# EAGLE design IMU_V1.0 (EAGLE 9.4.1)
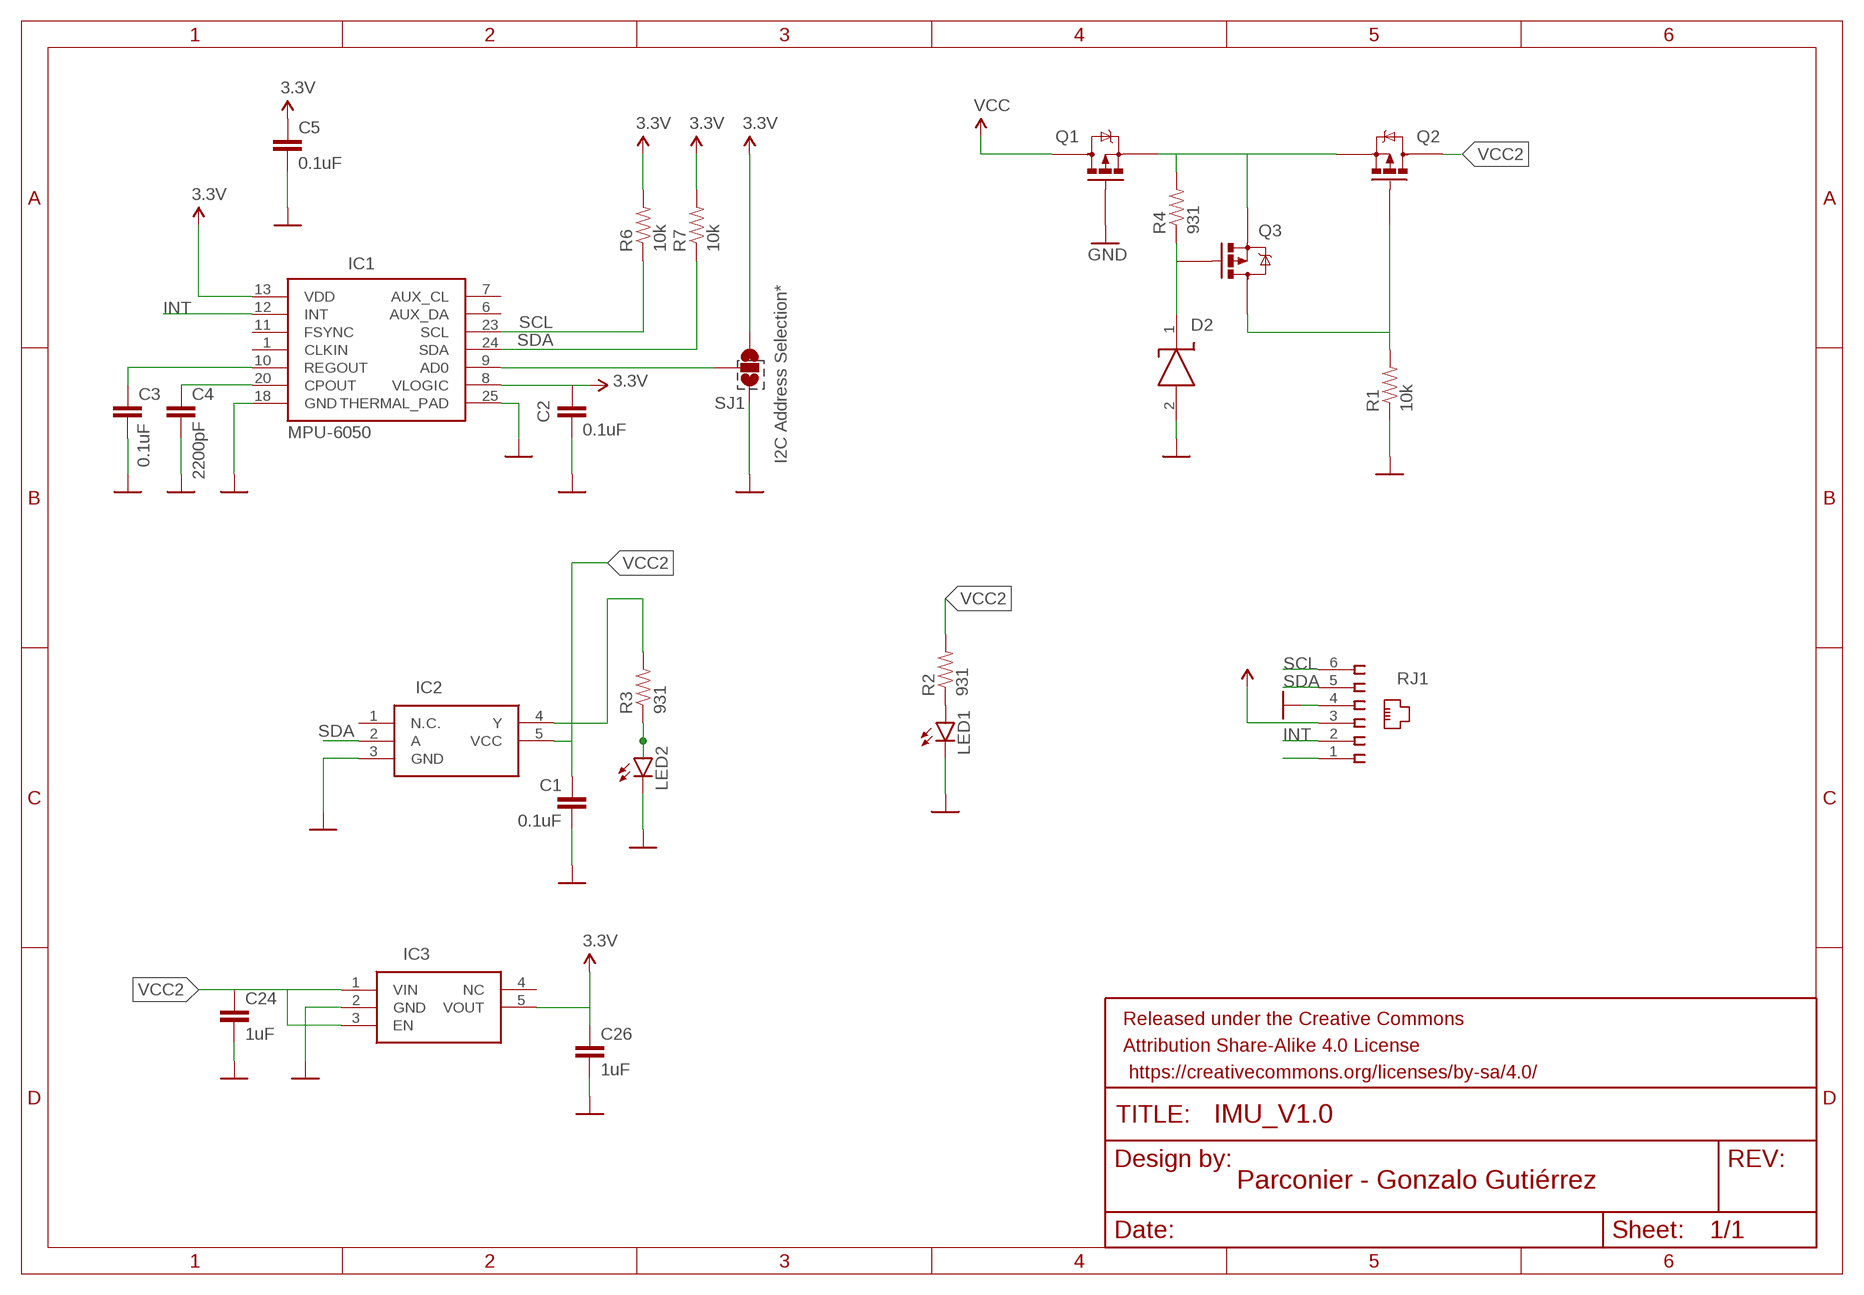
[diagram p0: schematic, sheet 1]

## Parts
C1  0.1uF  CAP_0402  [0402]
C2  0.1uF  CAP_0402  [0402]
C3  0.1uF  CAP_0402  [0402]
C4  2200pF  CAP_0402  [0402]
C5  0.1uF  CAP_0402  [0402]
C24  1uF  CAP_0402  [0402]
C26  1uF  CAP_0402  [0402]
D2  BZT52C5V1-7-F  [SOD3716X145N]
IC1  MPU-6050  [QFN50P400X400X95-25N]
IC2  74LVC1G14GW-Q100,1  [SOT65P212X110-5N]
IC3  MIC5504-3.3YM5-TR  [SOT95P280X145-5N]
LED1  LED0603  [LED-0603]
LED2  LED0603  [LED-0603]
Q1  RU1C002ZPTCL  [SOTFL65P210X105-3N]
Q2  RU1C002ZPTCL  [SOTFL65P210X105-3N]
Q3  RU1C002ZPTCL  [SOTFL65P210X105-3N]
R1  10k  RES_0402  [RESC1005X35]
R2  931  RES_0402  [RESC1005X35]
R3  931  RES_0402  [RESC1005X35]
R4  931  RES_0402  [RESC1005X35]
R6  10k  RES_0402  [RESC1005X35]
R7  10k  RES_0402  [RESC1005X35]
RJ1  615006138421  [615006138421]
SJ1  SOLDERJUMPER_2WAYPASTE2&3  [SJ_3_PASTE2&3]

## Nets
3.3V: C2.1 C5.1 C26.1 IC1.8(VLOGIC) IC1.13(VDD) IC3.5(VOUT) R6.2 R7.2 SJ1.1
GND: C1.2 C2.2 C3.2 C4.2 C5.2 C24.2 C26.2 D2.2(A) IC1.18(GND) IC1.25(THERMAL_PAD) IC2.3(GND) IC3.2(GND) LED1.C LED2.C Q1.1(G) R1.1 RJ1.4 SJ1.3
INT: IC1.12(INT) RJ1.2
N$1: Q1.2(S) Q2.2(S) Q3.2(S) R4.2
N$2: Q2.1(G) Q3.3(D) R1.2
N$3: D2.1(K) Q3.1(G) R4.1
N$4: IC2.4(Y) R3.2
N$5: LED2.A R3.1
N$9: C4.1 IC1.20(CPOUT)
N$10: C3.1 IC1.10(REGOUT)
N$11: RJ1.1
N$20: IC1.9(AD0) SJ1.2
N$30: LED1.A R2.1
SCL: IC1.23(SCL) R6.1 RJ1.6
SDA: IC1.24(SDA) IC2.2(A) R7.1 RJ1.5
VCC: Q1.3(D) RJ1.3
VCC2: C1.1 C24.1 IC2.5(VCC) IC3.1(VIN) IC3.3(EN) Q2.3(D) R2.2
Unconnected: IC1.1(CLKIN) IC1.6(AUX_DA) IC1.7(AUX_CL) IC1.11(FSYNC) IC2.1(N.C.) IC3.4(NC)

## Notes on the sheet
- I2C Address Selection*

## Library data of the parts
C1-C3 C5 = Perfect_0402:CAP_0402: 0402 (1005 Metric) Nick Garner - TeleSense; MPN: CC0402KRX5R9BB104
C4 = Perfect_0402:CAP_0402: 0402 (1005 Metric) Nick Garner - TeleSense; MPN: GRM155R71H222JA01D
C24 C26 = Perfect_0402:CAP_0402: 0402 (1005 Metric) Nick Garner - TeleSense; MPN: CC0402ZRY5V6BB105
D2 = BZT52C5V1-7-F:BZT52C5V1-7-F: Zener Diode 5.1V 5.8% 500mW SOD123 Diodes Inc BZT52C5V1-7-F Zener Diode, 5.1V 6% 0.5 W SMT 2-Pin SOD-123 Source: Datasheet <https://componentsearchengine.com/Datasheets/2/BZT52C5V1-7-F.pdf>; ALLIED_NUMBER: 71028127; ALLIED_PRICE/STOCK: https://www.alliedelec.com/diodes-inc-bzt52c5v1-7-f/71028127/; ARROW_PART_NUMBER: BZT52C5V1-7-F; ARROW_PRICE/STOCK: https://www.arrow.com/en/products/bzt52c5v1-7-f/diodes-incorporated; DESCRIPTION: Zener Diode 5.1V 5.8% 500mW SOD123 Diodes Inc BZT52C5V1-7-F Zener Diode, 5.1V 6% 0.5 W SMT 2-Pin SOD-123; HEIGHT: 1.45mm; MANUFACTURER_NAME: Diodes Inc.; MANUFACTURER_PART_NUMBER: BZT52C5V1-7-F; MPN: BZT52C5V1-7-F; RS_PART_NUMBER: 7384951P; RS_PRICE/STOCK: http://uk.rs-online.com/web/p/products/7384951P
IC1 = MPU-6050:MPU-6050: Gyro & Accelerometer 6 Axis I2C,MEMs InvenSense MPU-6050 6-Axis Motion Sensor Module Source: Datasheet <http://store.invensense.com/datasheets/invensense/MPU-6050_DataSheet_V3 4.pdf>; DESCRIPTION: Gyro & Accelerometer 6 Axis I2C,MEMs InvenSense MPU-6050 6-Axis Motion Sensor Module; HEIGHT: 0.95mm; MANUFACTURER_NAME: InvenSense Inc.; MANUFACTURER_PART_NUMBER: MPU-6050; MOUSER_PART_NUMBER: N/A; MOUSER_PRICE-STOCK: http://www.mouser.com/Search/ProductDetail.aspx?qs=u4fy%2fsgLU9O14B5JgyQFvg%3d%3d; MPN: MPU-6050; RS_PART_NUMBER: 8837948P; RS_PRICE-STOCK: http://uk.rs-online.com/web/p/products/8837948P
IC2 = 74LVC1G14GW-Q100_1:74LVC1G14GW-Q100,1: Inverter SchmittTrigger CMOS Auto TSSOP5 Source: Datasheet <https://assets.nexperia.com/documents/data-sheet/74LVC1G14_Q100.pdf>; ARROW_PART_NUMBER: 74LVC1G14GW-Q100,1; ARROW_PRICE/STOCK: https://www.arrow.com/en/products/74lvc1g14gw-q1001/nexperia; DESCRIPTION: Inverter SchmittTrigger CMOS Auto TSSOP5; HEIGHT: 1.1mm; MANUFACTURER_NAME: Nexperia; MANUFACTURER_PART_NUMBER: 74LVC1G14GW-Q100,1; MPN: 74AHC1G14GW-Q100,1; RS_PART_NUMBER: 1526474; RS_PRICE/STOCK: http://befr.rs-online.com/web/p/products/1526474
IC3 = MIC5504-3.3YM5-TR:MIC5504-3.3YM5-TR: LDO Voltage Regulators Single 300mA LDO Source: Datasheet <http://docs-europe.electrocomponents.com/webdocs/141e/0900766b8141ed4f.pdf>; DESCRIPTION: LDO Voltage Regulators Single 300mA LDO; HEIGHT: 1.45mm; MANUFACTURER_NAME: Micrel; MANUFACTURER_PART_NUMBER: MIC5504-3.3YM5-TR; MPN: MIC5504-3.3YM5-TR; RS_PART_NUMBER: 9113332; SUPPLIER_NAME: RS
LED1 = SparkFun-LED:LED: LEDs Standard schematic elements and footprints for 5mm, 3mm, 1206, and 0603 sized LEDs. 5mm - Spark Fun Electronics SKU : COM-00529 (and others); MPN: LTST-C193KRKT-5A
LED2 = SparkFun-LED:LED: LEDs Standard schematic elements and footprints for 5mm, 3mm, 1206, and 0603 sized LEDs. 5mm - Spark Fun Electronics SKU : COM-00529 (and others); MPN: LB Q39E-L2OO-35-1
Q1-Q3 = RU1C002ZPTCL:RU1C002ZPTCL: ROHM - RU1C002ZPTCL - MOSFET, P-CH, -20V, -0.2A, SOT-323FL Source: Datasheet <https://componentsearchengine.com/Datasheets/2/RU1C002ZPTCL.pdf>; ARROW_PART_NUMBER: RU1C002ZPTCL; DESCRIPTION: ROHM - RU1C002ZPTCL - MOSFET, P-CH, -20V, -0.2A, SOT-323FL; HEIGHT: 1.05mm; MANUFACTURER_NAME: ROHM Semiconductor; MANUFACTURER_PART_NUMBER: RU1C002ZPTCL; MPN: RU1C002ZPTCL
R1 R6 R7 = Perfect_0402:RES_0402; MPN: RC0402JR-7W10KL
R2-R4 = Perfect_0402:RES_0402; MPN: RC0402FR-07931RL
RJ1 = 615006138421:615006138421: HORIZONTAL PLASTIC 6P6C MODULAR JACK TAP UP Source: Datasheet <http://docs-europe.electrocomponents.com/webdocs/0f88/0900766b80f88670.pdf>; DESCRIPTION: HORIZONTAL PLASTIC 6P6C MODULAR JACK TAP UP; HEIGHT: mm; MANUFACTURER_NAME: W&uuml;rth Elektronik; MANUFACTURER_PART_NUMBER: 615006138421; MPN: 615006138421; RS_PART_NUMBER: 7350282; SUPPLIER_NAME: RS
SJ1 = SparkFun:SOLDERJUMPER_2WAY: Solder Jumper 2 way solder jumper

## Net classes
0 default: width 0.254 mm, clearance 0.152 mm
1 power: width 0.61 mm
2 gnd: width 0.305 mm, drill 0.559 mm, clearance 0.254 mm

## Board
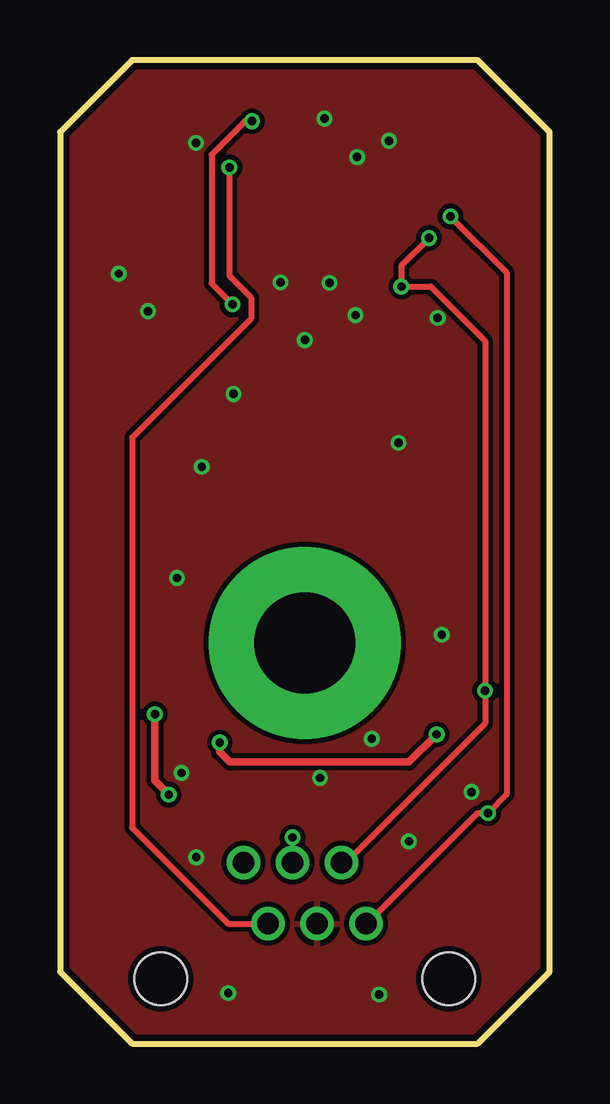
[diagram p1: board, top side]
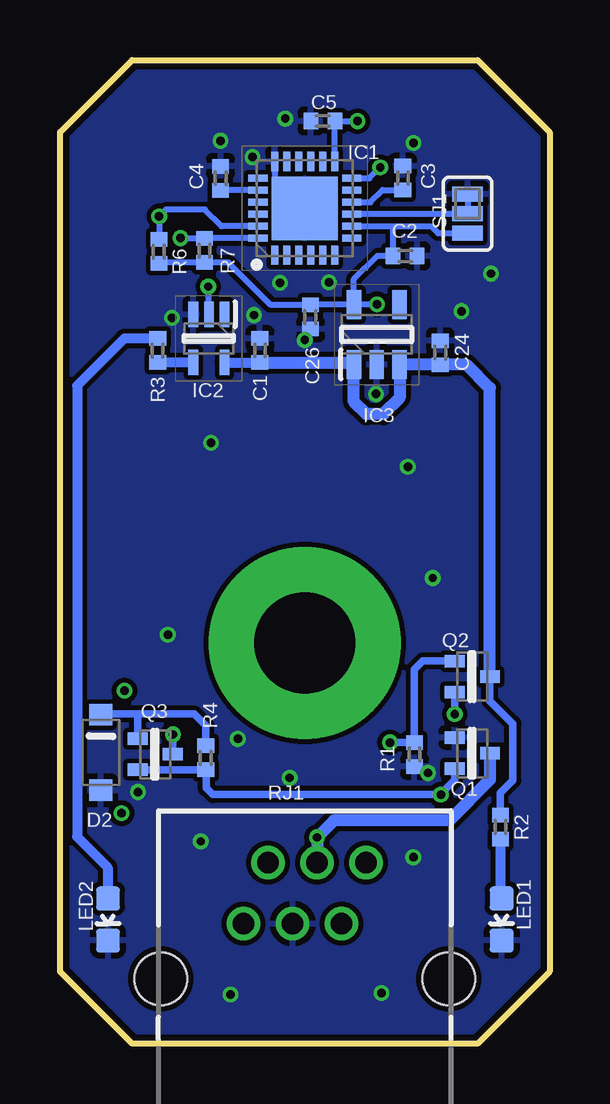
[diagram p2: board, bottom side, seen from below]

Size 20.4 x 41 mm. Coordinates in mm from the lower left corner, seen from the top.
Outline: 0,38 0,3 3,0 17.4,0 20.4,3 20.4,38 17.4,41 3,41 0,38
Copper layers (1*16): Top 0.035mm / dielectric 1.5mm / Bottom 0.035mm
Design rules "SeeedStudio_2layer_DRU_no_angle_20140221": minimum track width 6mil, minimum drill 12mil, track to track 6mil, track to pad 6mil, pad to pad 6mil, via to via 6mil, smd to smd 0mil, copper to edge 10mil, drill to drill 10mil, minimum pad ring 10mil, minimum via ring 6mil, stop-mask expansion 2mil, vias tented up to drill 100mil, thermal gap 10mil

### Footprints (pad centres in the part's own frame; a part is rotated, then mirrored left to right if it is on the bottom)
0402 = smd 0.6 x 0.7: 1 -0.5,0; 2 0.5,0
SOD3716X145N = smd 0.9 x 0.95: 1 -1.575,0; 2 1.575,0
QFN50P400X400X95-25N = smd 0.8 x 0.3: 1 -1.95,1.25; 2 -1.95,0.75; 3 -1.95,0.25; 4 -1.95,-0.25; 5 -1.95,-0.75; 6 -1.95,-1.25; 13 1.95,-1.25; 14 1.95,-0.75; 15 1.95,-0.25; 16 1.95,0.25; 17 1.95,0.75; 18 1.95,1.25 | smd 0.3 x 0.8: 7 -1.25,-1.95; 8 -0.75,-1.95; 9 -0.25,-1.95; 10 0.25,-1.95; 11 0.75,-1.95; 12 1.25,-1.95; 19 1.25,1.95; 20 0.75,1.95; 21 0.25,1.95; 22 -0.25,1.95; 23 -0.75,1.95; 24 -1.25,1.95 | smd 2.65 x 2.75: 25 0,0
SOT65P212X110-5N = smd 1.05 x 0.4: 1 -1,0.65; 2 -1,0; 3 -1,-0.65; 4 1,-0.65; 5 1,0.65
SOT95P280X145-5N = smd 1.2 x 0.6: 1 -1.25,0.95; 2 -1.25,0; 3 -1.25,-0.95; 4 1.25,-0.95; 5 1.25,0.95
LED-0603 = smd 1 x 1: A 0,-0.877; C 0,0.877
SOTFL65P210X105-3N = smd 0.83 x 0.52: 1 -0.735,0.65; 2 -0.735,-0.65; 3 0.735,0
RESC1005X35 = smd 0.6 x 0.7: 1 -0.5,0; 2 0.5,0
615006138421 = drill 0.9 pad 1.4: 1 2.55,4.84; 2 1.53,2.3; 3 0.51,4.84; 4 -0.51,2.3; 5 -1.53,4.84; 6 -2.55,2.3 | hole 2.2: -6,0; 6,0
SJ_3_PASTE2&3 = smd 0.635 x 1.27: 1 -0.813,0; 2 0,0; 3 0.813,0

### Placement (x,y rotation side)
C1  12.07,28.89 90 bottom
C2  6.02,32.83 0 bottom
C3  6.12,36.08 90 bottom
C4  13.71,36.07 90 bottom
C5  9.44,38.46 180 bottom
C24  4.56,28.8 90 bottom
C26  9.96,30.29 270 bottom
D2  18.7,12.13 270 bottom
IC1  10.2,34.82 90 bottom
IC2  14.2,29.39 270 bottom
IC3  7.2,29.56 90 bottom
LED1  2,5.17 180 bottom
LED2  18.4,5.17 180 bottom
Q1  3.22,12.1 0 bottom
Q2  3.22,15.29 0 bottom
Q3  16.43,12.06 0 bottom
R1  5.63,12.05 90 bottom
R2  2.05,9.02 90 bottom
R3  16.33,28.89 270 bottom
R4  14.33,11.91 270 bottom
R6  16.28,33.02 270 bottom
R7  14.38,33.06 270 bottom
RJ1  10.2,2.7 0 bottom
SJ1  3.42,34.6 90 bottom

### Tracks (layer width: path | path; a pad name or v marks a point on that pad's centre or on a via)
3.3V  (via drill 0.35)
  Top 0.254: v8,38.45 7.71,38.45 6.32,37.06 6.32,31.68 v7.19,30.81
  Bottom 0.254: IC1.8 6.55,34.07 | 6.55,34.07 4.94,34.07 4.64,33.77 SJ1.1 | 6.55,34.07 6.52,34.04 C2.1 6.53,32.84 7.16,32.84 8.15,31.86 IC3.5 | v8,38.45 v8.01,38.46 C5.1 IC1.13 | v7.19,30.81 IC3.5 | R7.2 16.23,32.56 R6.2 | IC3.5 9.94,30.81 C26.1 11.61,30.79 13.38,32.56 R7.2 | R7.2 14.39,32.57
  Bottom 0.406: SJ1.1
GND  (via drill 0.35)
  Bottom 0.254: SJ1.3 3.42,34.81 | IC1.18 11.45,36.07 IC1.25
  other vias: 7.01,2.1 13.3,2.04 5.67,37.54 13.71,37.63 12.38,36.95 11.02,38.56 2.45,32.09 10.2,29.33 12.32,30.36 15.74,30.25 5.06,11.28 10.83,11.07 17.15,10.49 12.99,12.7 5.91,24.05 14.1,25.05 15.91,17.05 4.87,19.41 14.54,8.43 5.68,7.76 9.19,31.73 11.23,31.7 3.67,30.53 7.23,27.08
  pour Bottom (isolate 0.2): 20.4,0 0,0 0,41 20.4,41
  pour Top (isolate 0.2): 20.4,41 0,41 0,0 20.4,0
INT  (via drill 0.35)
  Top 0.254: v7.06,36.52 7.06,32 7.96,31.09 7.96,30.23 3,25.26 3,9 7,5 RJ1.2
  Bottom 0.254: IC1.12 7.51,36.07 v7.06,36.52
N$1  (via drill 0.35)
  Top 0.305: v3.95,13.73 3.95,10.96 v4.53,10.38
  Bottom 0.254: 14.38,11.41 R4.2
  Bottom 0.305: Q2.2 v3.95,13.73 | Q1.2 3.95,10.99 3.96,10.99 4.53,10.41 v4.53,10.38 14.03,10.38 14.31,10.65 | 14.31,10.65 14.29,10.67 | Q3.2 14.38,11.41 14.31,11.34 14.31,10.65
N$2  (via drill 0.35)
  Top 0.305: v15.69,12.89 14.54,11.73 7.08,11.73 6.66,12.15 v6.66,12.55
  Bottom 0.305: Q2.1 5.29,15.94 5.64,15.59 5.64,12.56 R1.2 v6.66,12.55 | Q3.3 v15.69,12.89
N$3
  Bottom 0.305: R4.1 14.33,13.25 14.81,13.73 17.15,13.73 | 17.15,13.73 18.67,13.73 D2.1 | Q3.1 17.16,13.72 17.15,13.73
N$4
  Bottom 0.406: IC2.4 R3.2
N$5
  Bottom 0.254: LED2.A
  Bottom 0.406: R3.1 17.71,29.39 19.69,27.42 19.69,8.62 18.41,7.34 18.41,6.06 LED2.A
N$6  (via drill 4.2 pad 8)
  other vias: 10.2,16.7
N$9
  Bottom 0.254: IC1.20 C4.1
N$10
  Bottom 0.254: IC1.10 7.47,35.07 6.96,35.58 C3.1
N$20
  Bottom 0.254: IC1.9 3.37,34.57 3.4,34.6 SJ1.2
N$30
  Bottom 0.406: R2.1 2.05,6.1 LED1.A
SCL  (via drill 0.35)
  Top 0.254: v16.27,34.48 18.61,32.13 18.61,10.38 v17.84,9.6 17.39,9.6 12.79,5 RJ1.6
  Bottom 0.254: IC1.23 13.67,34.07 14.36,34.76 15.98,34.76 v16.27,34.48 16.27,33.53 R6.1
SDA  (via drill 0.35)
  Top 0.254: v15.38,33.58 14.22,32.42 v14.22,31.55 15.45,31.55 17.71,29.29 v17.71,14.71 17.71,13.35 11.9,7.54 RJ1.5
  Bottom 0.254: IC1.24 R7.1 15.36,33.56 v15.38,33.58 | v14.22,31.55 14.22,30.42 IC2.2
VCC  (via drill 0.35)
  Bottom 0.508: Q1.3 2.48,11 4.18,9.31 8.98,9.31 v9.69,8.59 RJ1.3
VCC2
  Bottom 0.254: IC2.5 | IC3.1
  Bottom 0.305: 2.5,15.31 Q2.3 2.48,14.33 2.51,14.31 1.53,13.33 1.53,10.97 2.05,10.45 R2.2
  Bottom 0.406: IC2.5 C1.1
  Bottom 0.508: Q2.3 2.48,27.32 3.46,28.3 C24.1 IC3.3 6.25,26.91 6.93,26.23 7.64,26.23 8.15,26.74 IC3.1 8.23,28.39 C1.1